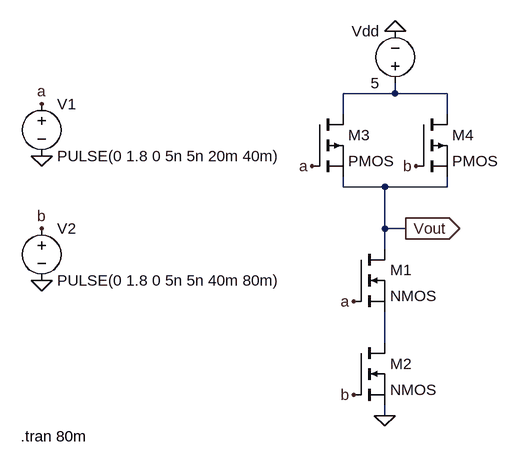
[diagram p0: schematic Nand_.asc]
Nand_.asc, the LTspice schematic file:
Version 4
SHEET 1 880 680
WIRE 256 -64 256 -80
WIRE 256 -64 176 -64
WIRE 336 -64 256 -64
WIRE 176 -32 176 -64
WIRE 336 -32 336 -64
WIRE 176 80 176 64
WIRE 240 80 176 80
WIRE 336 80 336 64
WIRE 336 80 240 80
WIRE 240 144 240 80
WIRE 272 144 240 144
WIRE 240 176 240 144
WIRE 240 320 240 272
WIRE 240 432 240 416
FLAG 240 432 0
FLAG 272 144 Vout
IOPIN 272 144 Out
FLAG -288 -48 a
FLAG 128 48 a
FLAG 192 256 a
FLAG -288 144 b
FLAG 288 48 b
FLAG 192 400 b
FLAG -288 32 0
FLAG -288 224 0
FLAG 256 -160 0
SYMBOL nmos 192 176 R0
SYMATTR InstName M1
SYMBOL nmos 192 320 R0
SYMATTR InstName M2
SYMBOL pmos 128 -32 R0
SYMATTR InstName M3
SYMBOL pmos 288 -32 R0
SYMATTR InstName M4
SYMBOL voltage 256 -64 R180
WINDOW 0 24 96 Left 2
WINDOW 3 24 16 Left 2
SYMATTR InstName Vdd
SYMATTR Value 5
SYMBOL voltage -288 -64 R0
WINDOW 123 0 0 Left 0
WINDOW 39 0 0 Left 0
SYMATTR InstName V1
SYMATTR Value PULSE(0 1.8 0 5n 5n 20m 40m)
SYMBOL voltage -288 128 R0
WINDOW 123 0 0 Left 0
WINDOW 39 0 0 Left 0
SYMATTR InstName V2
SYMATTR Value PULSE(0 1.8 0 5n 5n 40m 80m)
TEXT -320 464 Left 2 !.tran 80m

The netlist it stands for:
* Nand_.asc
M1 Vout a N002 N002 NMOS
M2 N002 b 0 0 NMOS
M3 N001 a Vout Vout PMOS
M4 N001 b Vout Vout PMOS
Vdd N001 0 5
V1 a 0 PULSE(0 1.8 0 5n 5n 20m 40m)
V2 b 0 PULSE(0 1.8 0 5n 5n 40m 80m)
.model NMOS NMOS
.model PMOS PMOS
.lib standard.mos
.tran 80m
.backanno
.end